# EAGLE design wristband (EAGLE 9.3.2)
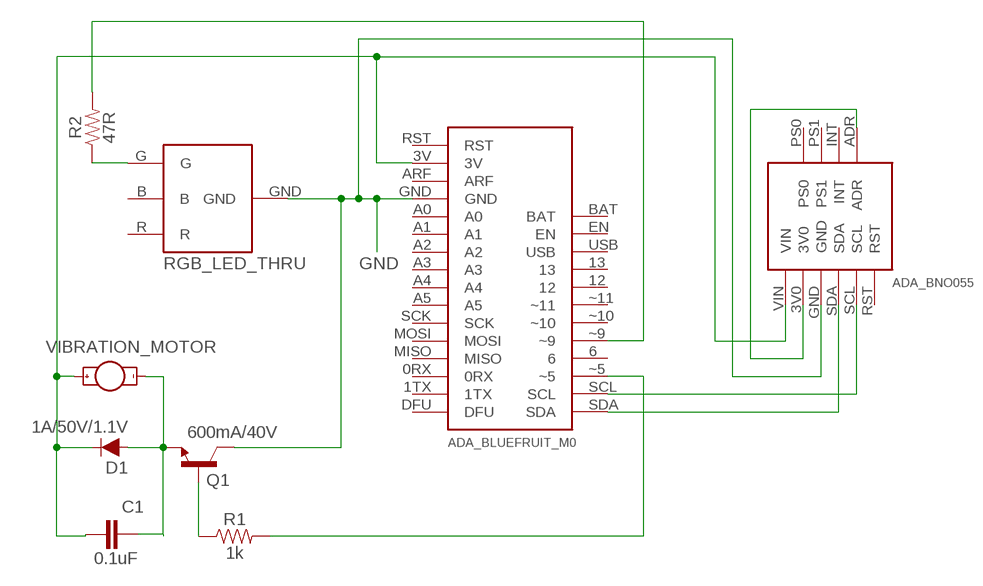
[diagram p0: schematic, sheet 1]

## Parts
BF1  ADA_BLUEFRUIT_M0  [ADA_BLUEFRUIT_M0]
BNO1  ADA_BNO055  [ADA_BNO055]
C1  0.1uF  0.1UF-KIT-EZ-50V-20%  [CAP-PTH-SMALL-KIT]
D1  1A/50V/1.1V  DIODE-PTH  [DIODE-1N4001]
Q1  600mA/40V  TRANS_NPN-P2N2222A  [TO-92]
R1  1k  1KOHM-HORIZ-1/4W-1%  [AXIAL-0.3]
R2  47R  1KOHM-HORIZ-1/4W-1%  [AXIAL-0.3]
RGB_LED1  RGB_LED_THRU  [RGB_LEB_RGB_2]
U$1  VIBRATION_MOTOR  [VIBRATION_MOTOR]

## Nets
GND: BF1.GND BNO1.GND Q1.1(C) RGB_LED1.GND
N$1: BF1.SDA BNO1.SDA
N$2: BF1.SCL BNO1.SCL
N$3: BF1.3V BNO1.VIN C1.1 D1.C U$1.+
N$5: BNO1.3V0 BNO1.ADR
N$7: R2.P$1 RGB_LED1.G
N$8: BF1.~9 R2.P$2
N$9: C1.2 D1.A Q1.3(E) U$1.-
N$10: Q1.2(B) R1.P$1
N$11: BF1.~5 R1.P$2
Unconnected: BF1.0RX BF1.1TX BF1.6 BF1.12 BF1.13 BF1.A0 BF1.A1 BF1.A2 BF1.A3 BF1.A4 BF1.A5 BF1.ARF BF1.BAT BF1.DFU BF1.EN BF1.MISO BF1.MOSI BF1.RST BF1.SCK BF1.USB BF1.~10 BF1.~11 BNO1.INT BNO1.PS0 BNO1.PS1 BNO1.RST RGB_LED1.B RGB_LED1.R

## Library data of the parts
BF1 = my_library:ADA_BLUEFRUIT_M0
BNO1 = my_library:ADA_BNO055
C1 = SparkFun-Capacitors:0.1UF: 0.1µF ceramic capacitors A capacitor is a passive two-terminal electrical component used to store electrical energy temporarily in an electric field.; PROD_ID: CAP-08370
D1 = SparkFun-DiscreteSemi:DIODE: Diode These are standard reverse protection diodes and small signal diodes. SparkFun Products: SparkFun SparkPunk Sound Kit <https://www.sparkfun.com/products/11177> SparkFun ESP8266 Thing <https://www.sparkfun.com/products/13231>; PROD_ID: DIO-09176
Q1 = SparkFun-DiscreteSemi:TRANS_NPN: NPN transistor Current controlled devices typically used to amplify current or used as a switch. BC547 - COM-08928 <http://www.sparkfun.com/products/8928> (TO-92 45V 100mA) (1.Collector 2.Base 3.Emitter) 2N3904 - COM-00521 <http://www.sparkfun.com/products/521> (TO-92 40V 200mA) (1.Emitter 2.Base 3.Collector) P2N2222A - COM-12852 <http://www.sparkfun.com/products/12852> (TO-92 40V 600mA) (1.Collector 2.Base 3.Emitter); PROD_ID: TRANS-09536
R1 = SparkFun-Resistors:1KOHM: 1kΩ resistor A resistor is a passive two-terminal electrical component that implements electrical resistance as a circuit element. Resistors act to reduce current flow, and, at the same time, act to lower voltage levels within circuits. - Wikipedia; PROD_ID: RES-12182
R2 = SparkFun-Resistors:1KOHM: 1kΩ resistor A resistor is a passive two-terminal electrical component that implements electrical resistance as a circuit element. Resistors act to reduce current flow, and, at the same time, act to lower voltage levels within circuits. - Wikipedia; PROD_ID: RES-12182; VALUE: 1k
RGB_LED1 = my_library:RGB_LED_THRU
U$1 = my_library:VIBRATION_MOTOR

## Board
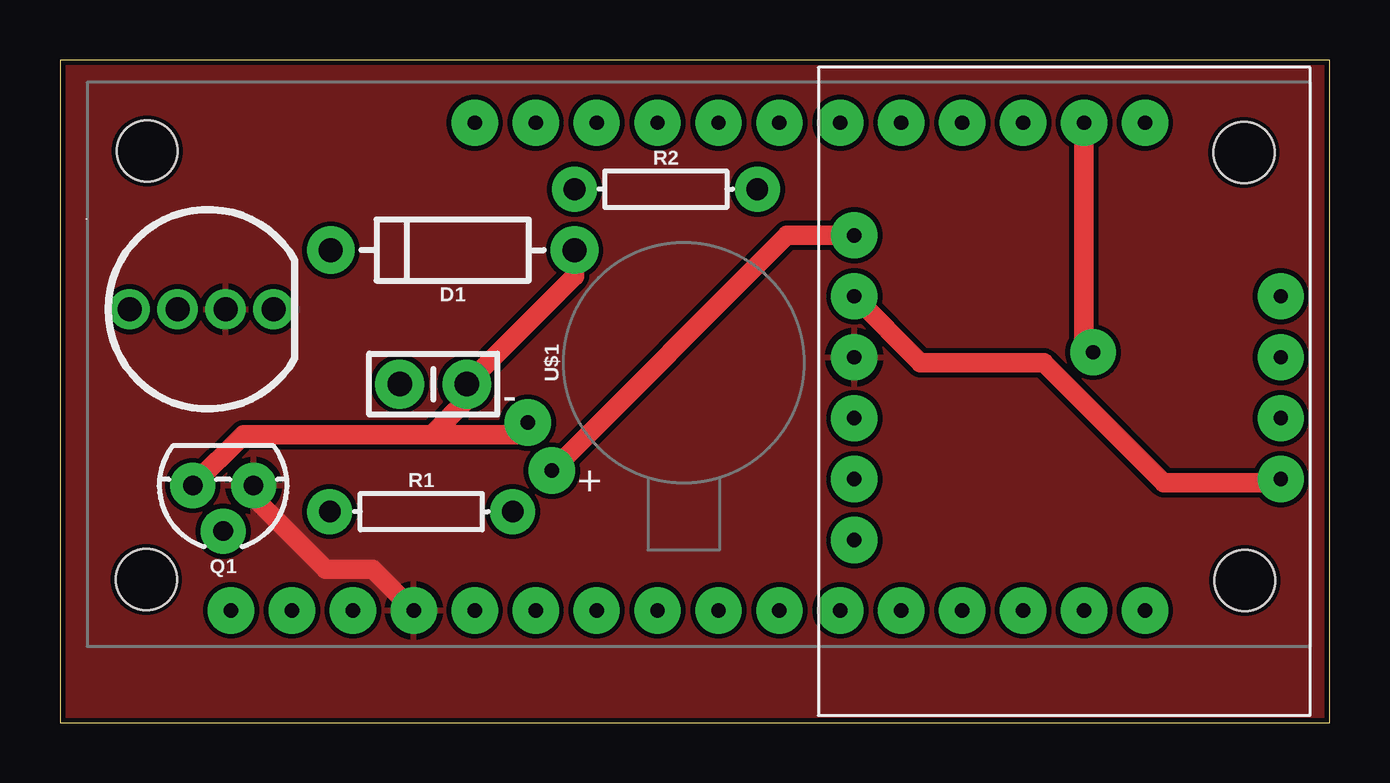
[diagram p1: board, top side]
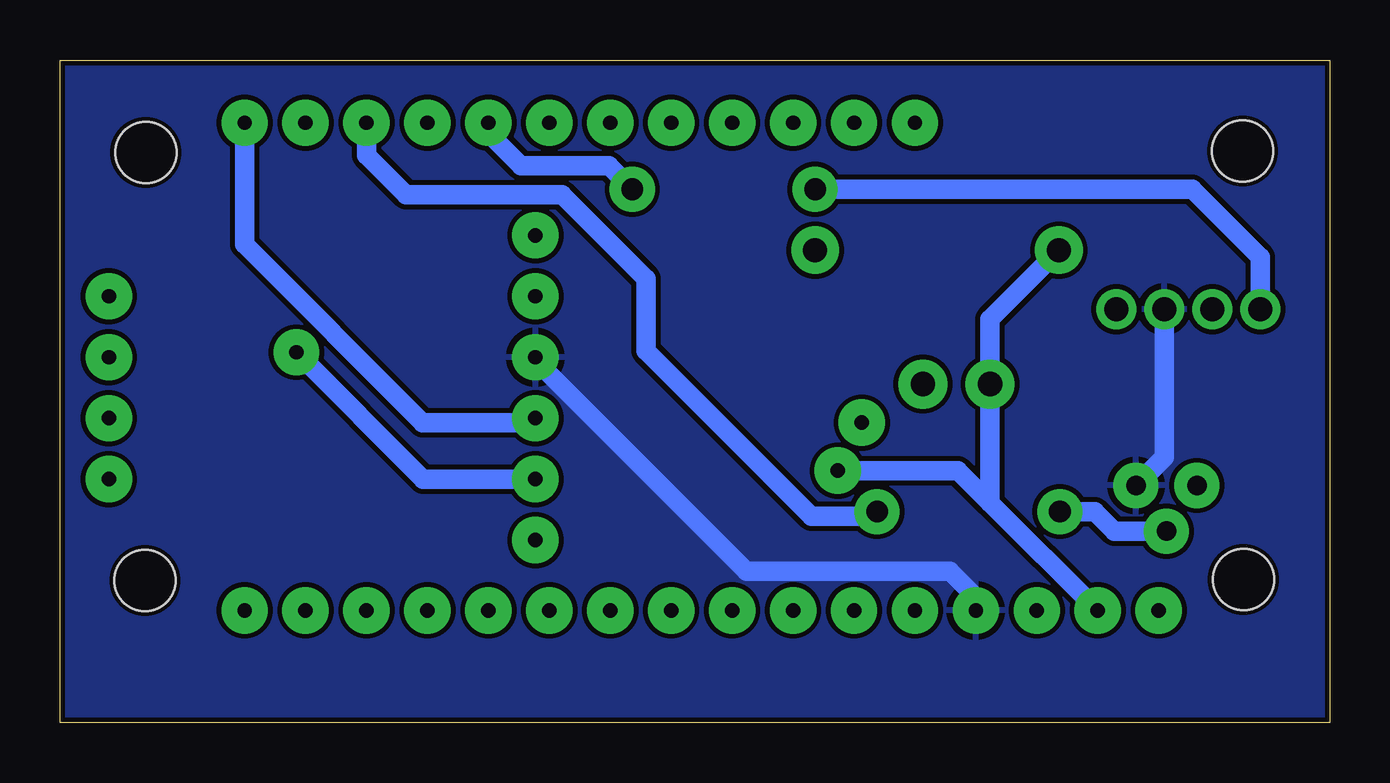
[diagram p2: board, bottom side, seen from below]

Size 52.92 x 27.61 mm. Coordinates in mm from the lower left corner, seen from the top.
Outline: 0,0 52.92,0 52.92,27.61 0,27.61 0,0
Copper layers (1*16): Top 0.035mm / dielectric 1.5mm / Bottom 0.035mm
Design rules "SparkFun": minimum track width 8mil, minimum drill 20mil, track to track 8mil, track to pad 8mil, pad to pad 8mil, via to via 8mil, smd to smd 8mil, copper to edge 8mil, drill to drill 8mil, minimum pad ring 12mil, minimum via ring 10mil, stop-mask expansion 4mil, vias tented up to drill 20mil, thermal gap 10mil

### Footprints (pad centres in the part's own frame; a part is rotated, then mirrored left to right if it is on the bottom)
ADA_BLUEFRUIT_M0 = drill 0.6 pad 1.93: 0RX 39.02,1.5; 1TX 41.56,1.5; 3V 8.54,1.5; 6 36.48,21.82; 12 26.32,21.82; 13 23.78,21.82; A0 16.16,1.5; A1 18.7,1.5; A2 21.24,1.5; A3 23.78,1.5; A4 26.32,1.5; A5 28.86,1.5; ARF 11.08,1.5; BAT 16.16,21.82; DFU 44.1,1.5; EN 18.7,21.82; GND 13.62,1.5; MISO 36.48,1.5; MOSI 33.94,1.5; RST 6,1.5; SCK 31.4,1.5; SCL 41.56,21.82; SDA 44.1,21.82; USB 21.24,21.82; ~5 39.02,21.82; ~9 33.94,21.82; ~10 31.4,21.82; ~11 28.86,21.82 | hole 2.54: 48.22,20.58; 48.26,2.75; 2.51,20.64; 2.47,2.79
ADA_BNO055 = drill 0.6 pad 1.93: 3V0 9.54,1.5; ADR 17.16,19.28; GND 12.08,1.5; INT 14.62,19.28; PS0 9.54,19.28; PS1 12.08,19.28; RST 19.7,1.5; SCL 17.16,1.5; SDA 14.62,1.5; VIN 7,1.5
CAP-PTH-SMALL-KIT = drill 1.016 pad 2.032: 1 -1.397,0; 2 1.397,0
DIODE-1N4001 = drill 1 pad 1.981: A -5.08,0; C 5.08,0
TO-92 = drill 0.813 pad 1.88: 1 -1.27,0; 2 0,1.905; 3 1.27,0
AXIAL-0.3 = drill 0.9 pad 1.88: P$1 -3.81,0; P$2 3.81,0
RGB_LEB_RGB_2 = drill 1 pad 1.676: B 2.5,0; G 0.5,0; GND 4.5,0; R 6.5,0
VIBRATION_MOTOR = drill 0.6 pad 1.93: + -5.5,-4.5; - -6.5,-2.5

### Placement (x,y rotation side)
BF1  1.13,3.17 0 top
BNO1  31.61,27.3 270 top
C1  15.56,14.11 0 top
D1  16.37,19.68 180 top
Q1  6.8,9.88 180 top
R1  15.06,8.79 0 top
R2  25.26,22.23 0 top
RGB_LED1  2.4,17.23 0 top
U$1  26,15 0 top

### Tracks (layer width: path | path; a pad name or v marks a point on that pad's centre or on a via)
GND
  Top 0.813: Q1.1 8.07,9.38 11.07,6.38 13.04,6.38 BF1.GND
  Bottom 0.813: RGB_LED1.GND 6.9,11.06 Q1.1 | BNO1.GND 33.11,15.11 24.3,6.3 15.83,6.3 14.75,5.21 BF1.GND
  pour Top: 0,27.5 0,0 53,0 53,27.5
  pour Bottom: 0,27.5 0,0 53,0 53,27.5
N$1
  Bottom 0.813: BNO1.SDA 33.29,12.5 37.8,12.5 45.23,19.93 BF1.SDA
N$2  (via drill 0.6 pad 1.9)
  Top 0.813: v43.07,15.43 42.69,15.81 BF1.SCL
  Bottom 0.813: BNO1.SCL 37.78,10.14 v43.07,15.43
N$3
  Top 0.813: U$1.+ 30.3,20.3 BNO1.VIN
  Bottom 0.813: 14.16,9.17 C1.1 14.16,16.81 D1.C | 14.16,9.17 BF1.3V | 14.16,9.17 15.49,10.5 U$1.+
N$5
  Top 0.813: BNO1.3V0 35.87,15 41,15 46,10 50.74,10 BNO1.ADR
N$7
  Bottom 0.813: R2.P$1 5.72,22.23 2.9,19.4 RGB_LED1.G
N$8
  Bottom 0.813: R2.P$2 30.04,23.2 33.7,23.2 35.07,24.57 BF1.~9
N$9
  Top 0.813: Q1.3 7.65,12 15.5,12 | 15.5,12 16.95,13.45 C1.2 21.45,18.6 D1.A | U$1.- 19,12 15.5,12
N$10
  Bottom 0.813: Q1.2 8.98,7.98 9.79,8.79 R1.P$1
N$11
  Bottom 0.813: R1.P$2 19.05,8.61 21.61,8.61 28.5,15.5 28.5,18.5 32,22 38.5,22 40.15,23.65 BF1.~5